# EAGLE design UMC (EAGLE 9.1.3)
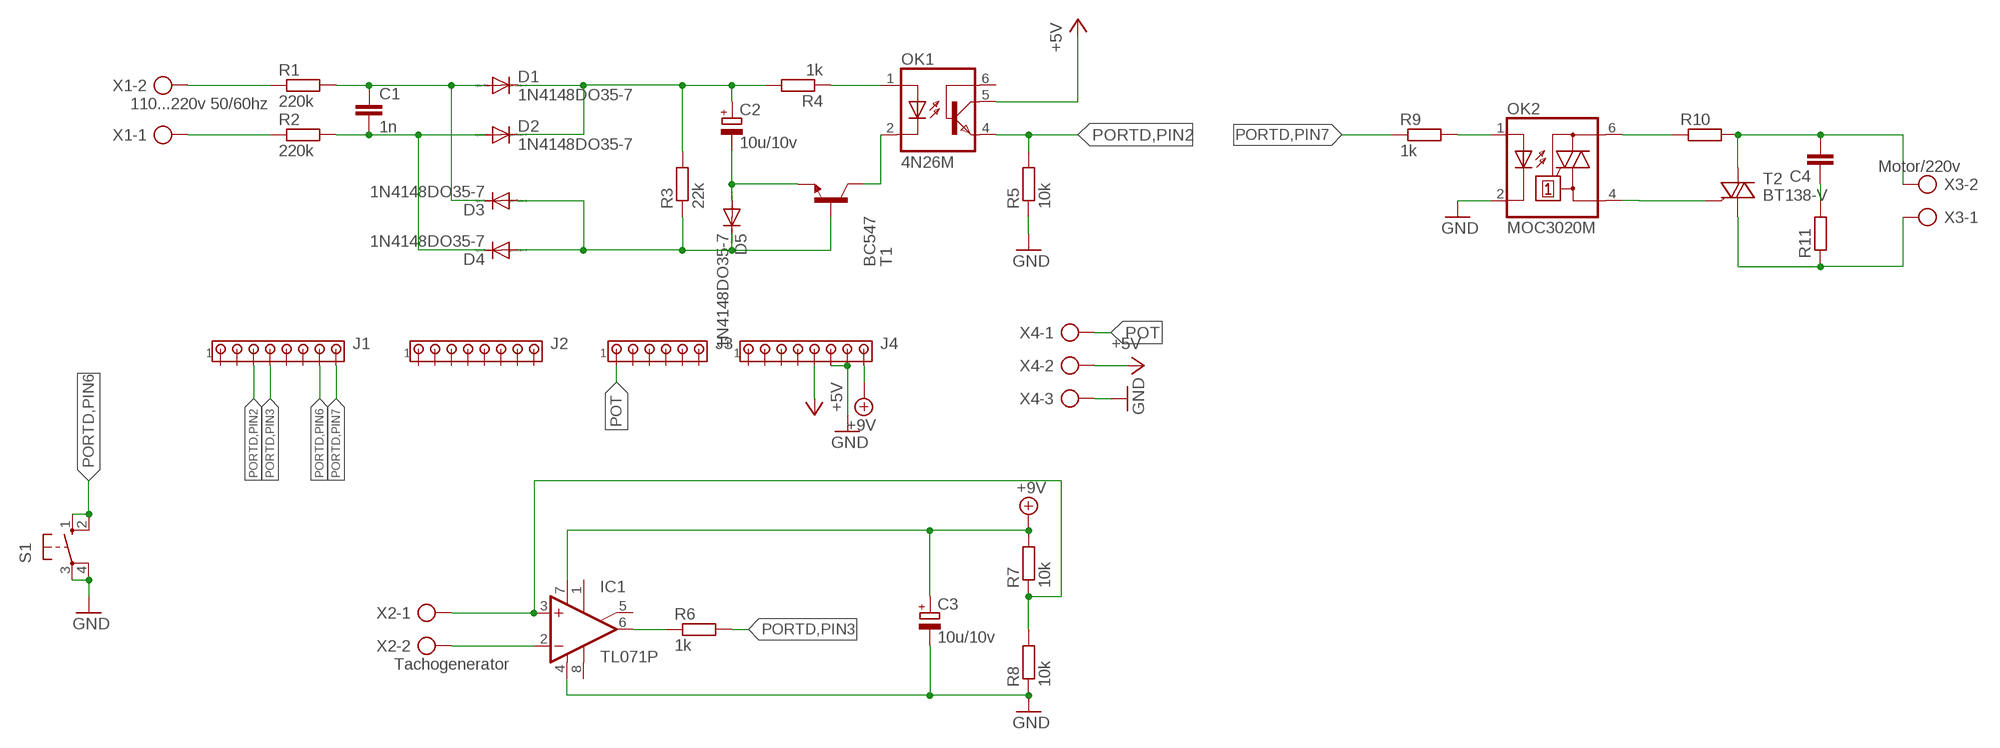
[diagram p0: schematic, sheet 1]

## Parts
C1  1n  C5/2.5  [C5B2.5]
C2  10u/10v  CPOL-EUE2.5-5  [E2,5-5]
C3  10u/10v  CPOL-EUE2.5-5  [E2,5-5]
C4  C15/7  [C15B7]
D1  1N4148DO35-7  [DO35-7]
D2  1N4148DO35-7  [DO35-7]
D3  1N4148DO35-7  [DO35-7]
D4  1N4148DO35-7  [DO35-7]
D5  1N4148DO35-7  [DO35-7]
IC1  TL071P  [DIL08]
J1  MTA08-100  [10X08MTA]
J2  MTA08-100  [10X08MTA]
J3  MTA06-100  [10X06MTA]
J4  MTA08-100  [10X08MTA]
OK1  4N26M  [DIL06]
OK2  MOC3020M  [DIL06]
R1  220k  R-EU_0207/7  [0207/7]
R2  220k  R-EU_0207/7  [0207/7]
R3  22k  R-EU_0207/7  [0207/7]
R4  1k  R-EU_0207/7  [0207/7]
R5  10k  R-EU_0207/7  [0207/7]
R6  1k  R-EU_0207/7  [0207/7]
R7  10k  R-EU_0207/7  [0207/7]
R8  10k  R-EU_0207/7  [0207/7]
R9  1k  R-EU_0207/7  [0207/7]
R10  R-EU_0207/7  [0207/7]
R11  R-EU_0411/12  [0411/12]
S1  10-XX  [B3F-10XX]
T1  BC547  [TO92]
T2  BT138-V  [TO220BV]
X1  110...220v 50/60hz  AK500/2  [AK500/2]
X2  Tachogenerator  AK500/2  [AK500/2]
X3  Motor/220v  AK500/2  [AK500/2]
X4  AK500/3  [AK500/3]

## Nets
+5V: J4.5 OK1.5(COL) X4.2
+9V: C3.+ IC1.7(V+) J4.8 R7.2
GND: C3.- IC1.4(V-) J4.6 J4.7 OK2.2(C) R5.1 R8.1 S1.3(P) S1.4(P1) X4.3
N$1: R1.1 X1.2
N$2: R2.1 X1.1
N$3: C1.1 D1.A D3.C R1.2
N$4: C1.2 D2.A D4.C R2.2
N$5: C2.+ D1.C D2.C R3.2 R4.2
N$6: D3.A D4.A D5.C R3.1 T1.2(B)
N$7: OK1.1(A) R4.1
N$8: OK1.2(C) T1.3(C)
N$9: C2.- D5.A T1.1(E)
N$10: OK2.1(A) R9.2
N$11: IC1.2(-IN) X2.2
N$12: IC1.6(OUT) R6.1
N$13: OK2.6(A2) R10.1
N$14: IC1.3(+IN) R7.1 R8.2 X2.1
N$15: C4.2 R10.2 T2.T2(A2) X3.2
N$16: C4.1 R11.2
N$17: OK2.4(A1) T2.G
N$18: R11.1 T2.T1(A1) X3.1
PORTD,PIN2: J1.3 OK1.4(EMI) R5.2
PORTD,PIN3: J1.4 R6.2
PORTD,PIN6: J1.7 S1.1(S) S1.2(S1)
PORTD,PIN7: J1.8 R9.1
POT: J3.1 X4.1
Unconnected: IC1.1(ON1) IC1.5(ON2) IC1.8(OPT) J1.1 J1.2 J1.5 J1.6 J2.1 J2.2 J2.3 J2.4 J2.5 J2.6 J2.7 J2.8 J3.2 J3.3 J3.4 J3.5 J3.6 J4.1 J4.2 J4.3 J4.4 OK1.6(BAS)

## Library data of the parts
C1 C4 = capacitor-wima:C: CAPACITOR naming: grid - package width
C2 C3 = resistor:CPOL-EU: POLARIZED CAPACITOR, European symbol
D1-D5 = diode:1N4148: DIODE high speed (Philips)
IC1 = linear:TL071: OP AMP
J1 J2 J4 = con-amp:MTA08-100: AMP connector
J3 = con-amp:MTA06-100: AMP connector Connection corrected 2014-09-19
OK1 = optocoupler:4N*?M: General Purpose 6-Pin Phototransistor Optocouplers Source: http://www.fairchildsemi.com/ds/4N/4N35-M.pdf; MPN: 4N26-M; OC_FARNELL: 1021350; OC_NEWARK: 98K9089
OK2 = optocoupler:MOC30*M: RANDOM-PHASE OPTOISOLATORS TRIAC DRIVER OUTPUT Source: http://www.fairchildsemi.com MOC3020-M.pdf; MF: FAIRCHILD SEMICONDUCTOR; MPN: MOC3020-M; OC_FARNELL: 1505425; OC_NEWARK: 72K8895
R1-R9 = resistor:R-EU_: RESISTOR, European symbol
R10 R11 = rcl:R-EU_: RESISTOR, European symbol; SPICEPREFIX: R
S1 = switch-omron:10-XX: OMRON SWITCH; MPN: B3F-1000; OC_FARNELL: 176432; OC_NEWARK: 36M3542
T1 = transistor:BC547: NPN TRANSISTOR
T2 = triac:BT138: TRIAC Source: http://www.semiconductors.philips.com BT138_SERIES_2.pdf
X1-X3 = con-ptr500:AK500/2: CONNECTOR; OC_FARNELL: unknown; OC_NEWARK: unknown
X4 = con-ptr500:AK500/3: CONNECTOR; OC_FARNELL: unknown; OC_NEWARK: unknown

## Board
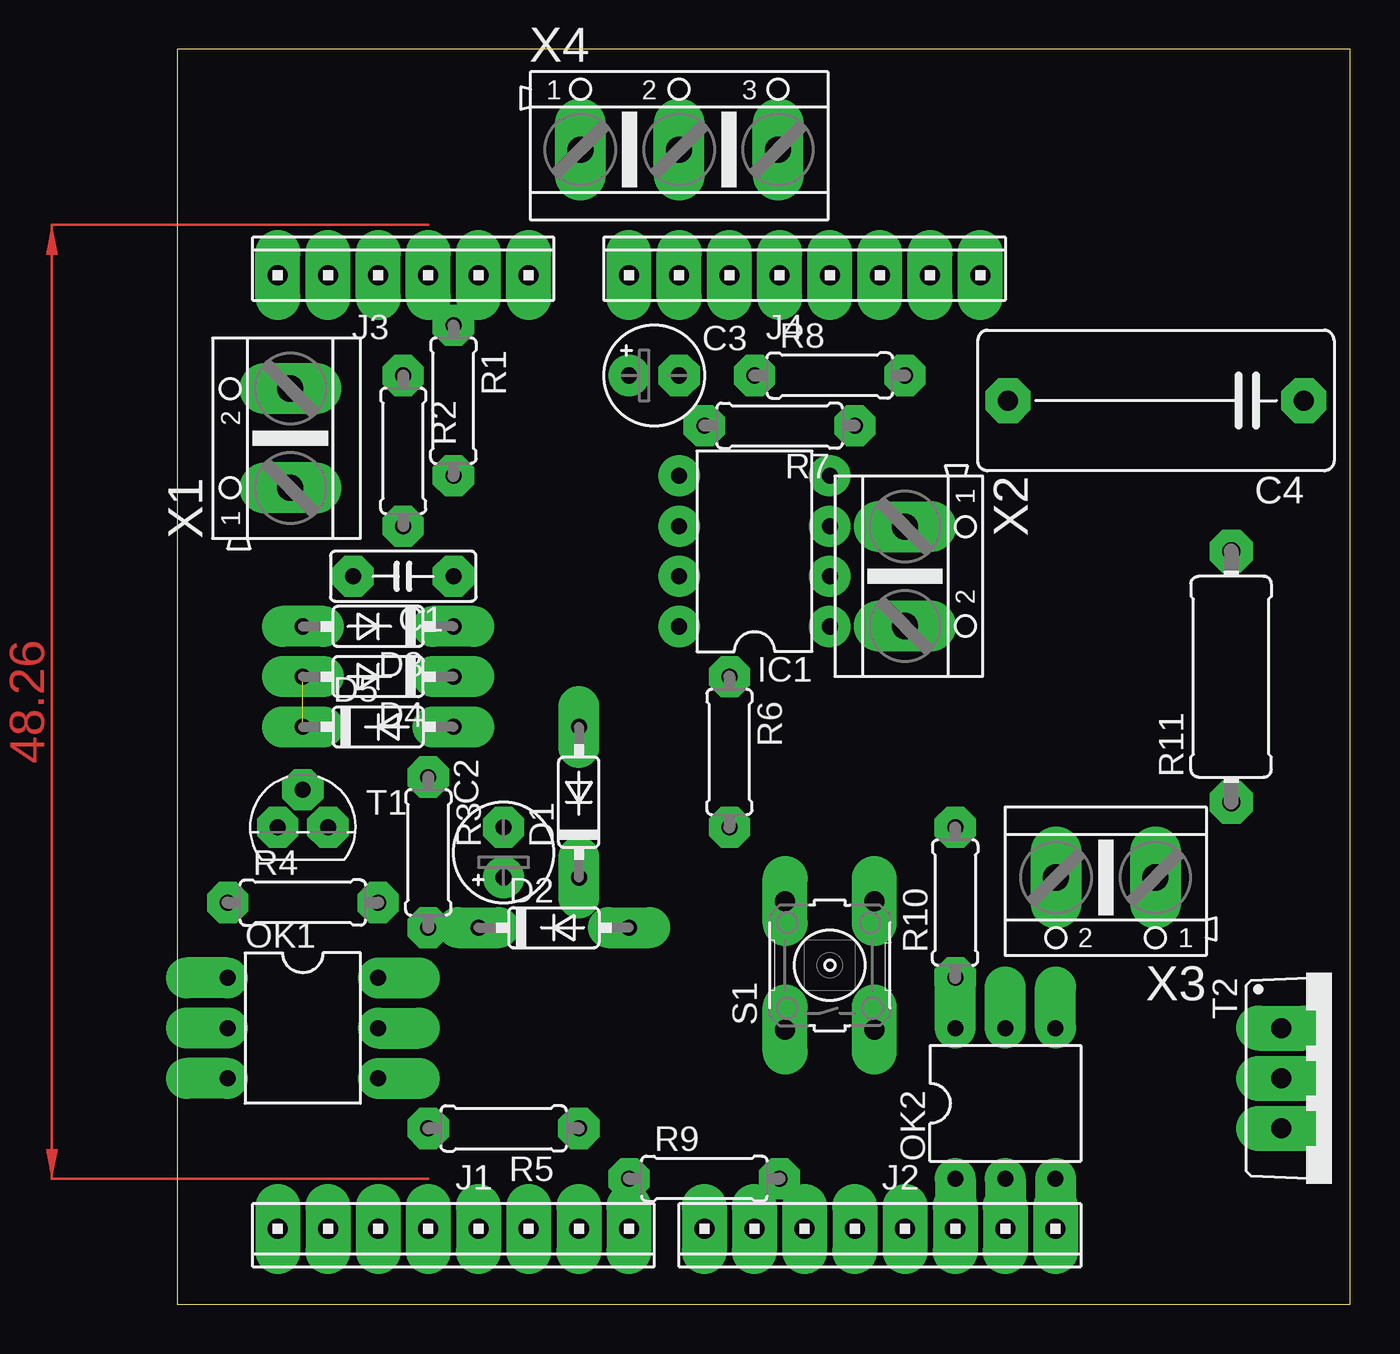
[diagram p1: board, top side]
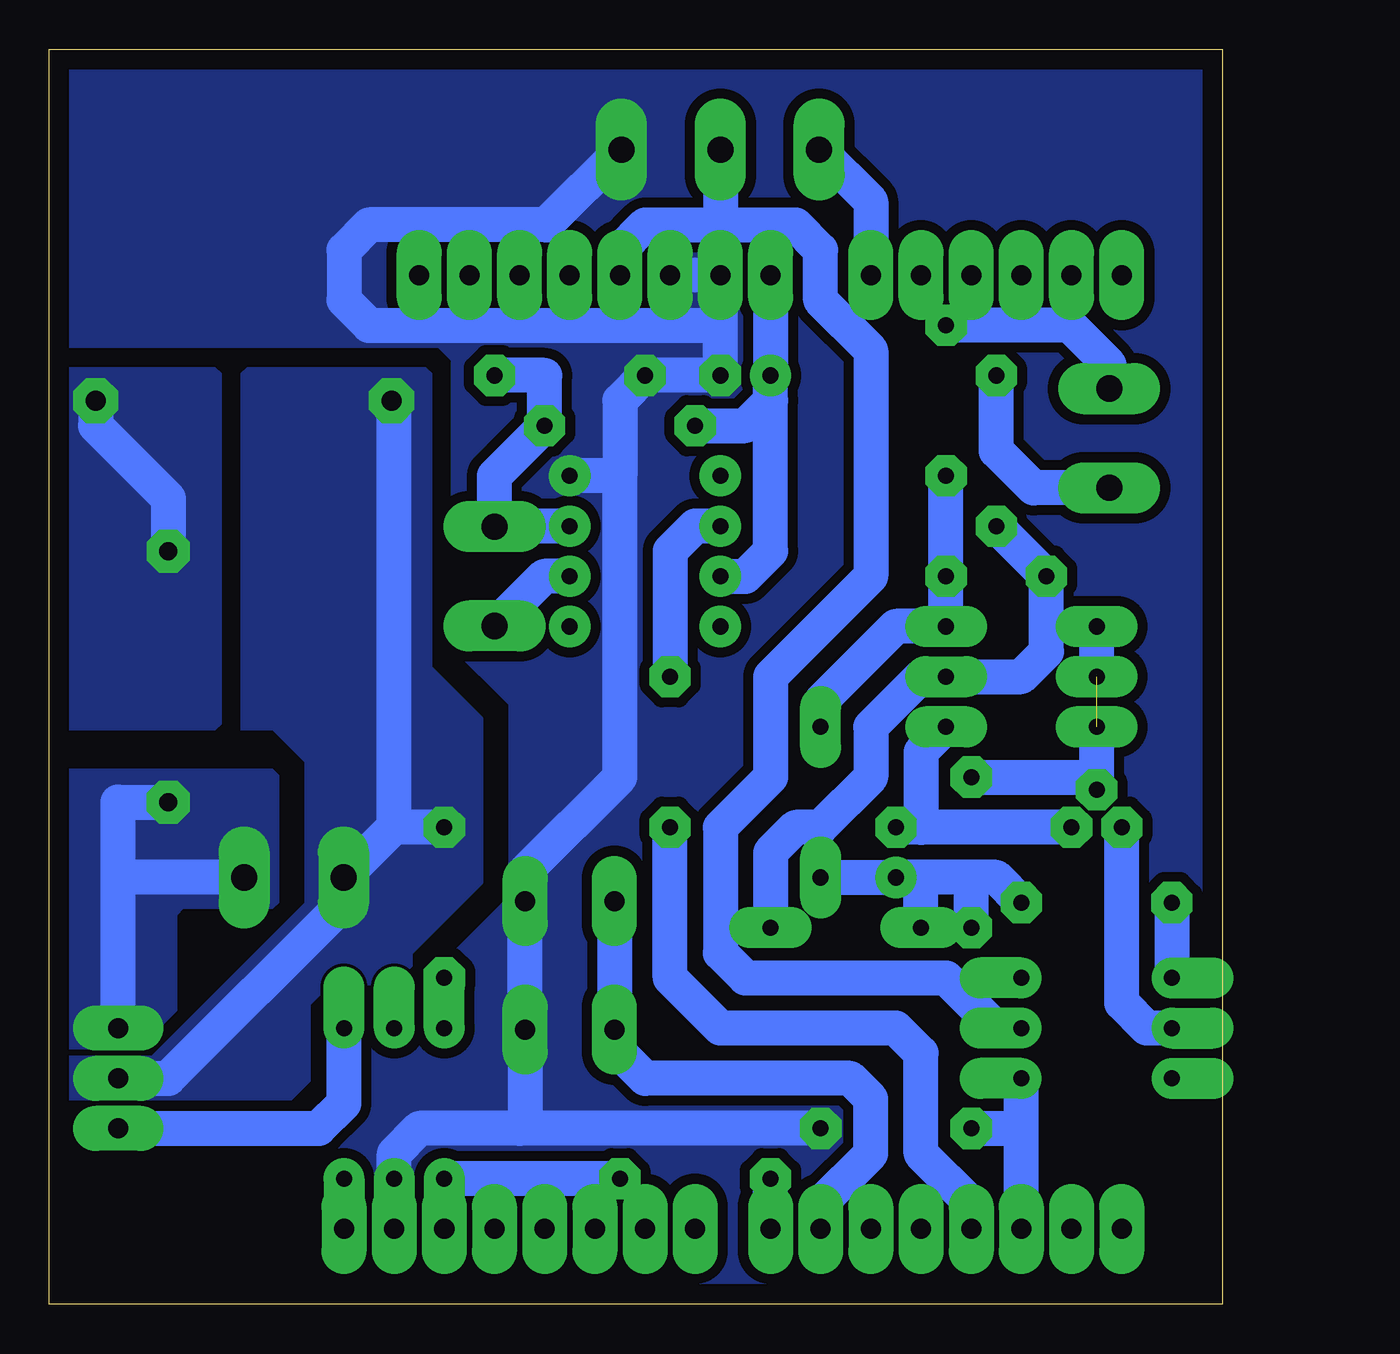
[diagram p2: board, bottom side, seen from below]

Size 59.36 x 63.49 mm. Coordinates in mm from the lower left corner, seen from the top.
Outline: 0,0 59.36,0 59.36,63.49 0,63.49 0,0
Copper layers (1*16): Top 0.035mm / dielectric 1.5mm / Bottom 0.035mm
Design rules "default *": minimum track width 6mil, minimum drill 0.35mm, track to track 6mil, track to pad 6mil, pad to pad 6mil, via to via 6mil, smd to smd 6mil, copper to edge 40mil, drill to drill 6mil, minimum pad ring 25mil, minimum via ring 8mil, stop-mask expansion 4mil, vias tented up to drill 0mil, thermal gap 10mil

### Footprints (pad centres in the part's own frame; a part is rotated, then mirrored left to right if it is on the bottom)
C5B2.5 = drill 0.813 pad 1.6 octagon: 1 -2.54,0; 2 2.54,0
E2,5-5 = drill 0.813 pad 1.6: + -1.27,0 | drill 0.813 pad 1.6 octagon: - 1.27,0
C15B7 = drill 1.016 pad 2.159 octagon: 1 -7.493,0; 2 7.493,0
DO35-7 = drill 0.813 long: A 3.81,0; C -3.81,0
DIL08 = drill 0.813 pad 1.27: 1 -3.81,-3.81; 2 -1.27,-3.81; 3 1.27,-3.81; 4 3.81,-3.81; 5 3.81,3.81; 6 1.27,3.81; 7 -1.27,3.81; 8 -3.81,3.81
10X08MTA = drill 1.016 long: 1 8.89,0; 2 6.35,0; 3 3.81,0; 4 1.27,0; 5 -1.27,0; 6 -3.81,0; 7 -6.35,0; 8 -8.89,0
10X06MTA = drill 1.016 long: 1 6.35,0; 2 3.81,0; 3 1.27,0; 4 -1.27,0; 5 -3.81,0; 6 -6.35,0
DIL06 = drill 0.813 offset: 1 -2.54,-3.81; 2 0,-3.81; 3 2.54,-3.81; 4 2.54,3.81; 5 0,3.81; 6 -2.54,3.81
0207/7 = drill 0.813 octagon: 1 -3.81,0; 2 3.81,0
0411/12 = drill 0.914 octagon: 1 -6.35,0; 2 6.35,0
B3F-10XX = drill 1.016 long: 1 -3.251,2.261; 2 3.251,2.261; 3 -3.251,-2.261; 4 3.251,-2.261
TO92 = drill 0.813 octagon: 1 1.27,0; 2 0,1.905; 3 -1.27,0
TO220BV = drill 1.016 long: G 2.54,-2.54; T1 -2.54,-2.54; T2 0,-2.54
AK500/2 = drill 1.321 long: 1 -2.515,0; 2 2.515,0
AK500/3 = drill 1.321 long: 1 -5.004,0; 2 0,0; 3 5.004,0

### Placement (x,y rotation side)
C1  11.43,36.83 180 top
C2  16.51,22.86 90 top
C3  24.13,46.99 0 top
C4  49.53,45.72 180 top
D1  20.32,25.4 90 top
D2  19.05,19.05 0 top
D3  10.16,34.29 180 top
D4  10.16,31.75 180 top
D5  10.16,29.21 0 top
IC1  29.21,38.1 90 top
J1  13.97,3.81 180 top
J2  35.56,3.81 180 top
J3  11.43,52.07 0 top
J4  31.75,52.07 0 top
OK1  6.35,13.97 270 top
OK2  41.91,10.16 0 top
R1  13.97,45.72 270 top
R2  11.43,43.18 270 top
R3  12.7,22.86 270 top
R4  6.35,20.32 0 top
R5  16.51,8.89 180 top
R6  27.94,27.94 270 top
R7  30.48,44.45 180 top
R8  33.02,46.99 0 top
R9  26.67,6.35 0 top
R10  39.37,20.32 90 top
R11  53.34,31.75 90 top
S1  33.02,17.14 90 top
T1  6.35,24.13 0 top
T2  58.42,11.43 270 top
X1  5.71,43.81 90 top
X2  36.83,36.83 270 top
X3  46.99,21.59 180 top
X4  25.4,58.42 0 top

### Tracks (layer width: path | path; a pad name or v marks a point on that pad's centre or on a via)
+5V
  Bottom 1.778: 30.4,52.15 J4.5 30.48,53.34 29.21,54.61 25.4,54.61 | 25.4,54.61 21.59,54.61 20.32,53.34 20.32,50.8 17.78,48.26 17.78,36.83 22.86,31.75 22.86,26.67 25.4,24.13 25.4,17.78 24.13,16.51 13.97,16.51 11.43,13.97 OK1.5 | X4.2 25.4,54.61
+9V
  Bottom 1.778: J4.8 C3.+ 22.86,45.72 | R7.2 24.13,44.45 22.86,45.72 | IC1.7 24.13,36.83 22.86,38.1 22.86,45.72
GND
  Bottom 1.778: J4.6 J4.7 25.4,49.53 | 25.4,49.53 C3.- R8.1 30.48,45.72 30.48,41.91 | 30.48,41.91 IC1.4 | R5.1 35.56,8.89 | 35.56,8.89 40.64,8.89 41.91,7.62 OK2.2 | 30.48,41.91 30.48,26.67 35.28,21.87 S1.4 S1.3 35.28,9.17 35.56,8.89 | X4.3 34.21,54.61 43.18,54.61 44.45,53.34 44.45,50.8 43.18,49.53 25.4,49.53
  pour Bottom (isolate 0.508, no thermals): 0.32,63.23 59.03,63.23 59.35,62.9 59.35,62.9 59.35,49.35 58.39,48.39 39.68,48.39 39.03,47.74 39.03,33.23 36.13,30.32 36.13,20.65 41.61,15.16 44.84,15.16 45.48,14.52 45.48,14.52 45.48,10.65 46.13,10 59.03,10 59.35,9.68 59.35,9.68 59.35,0.32 59.03,0 0.32,0 0,0.32 0,62.9
N$1
  Bottom 1.778: X1.2 5.71,47.53 7.71,49.53 R1.1
N$2
  Bottom 1.778: X1.1 9.55,41.3 11.43,43.18 R2.1
N$3
  Bottom 1.778: R1.2 C1.1 D3.C 16.51,34.29 20.32,30.48 D1.A
N$4
  Bottom 1.778: D2.A 22.86,22.86 21.59,24.13 20.32,24.13 17.78,26.67 17.78,29.21 15.24,31.75 D4.C 10.16,31.75 8.89,33.02 C1.2 R2.2
N$5
  Bottom 1.778: R4.2 11.43,21.59 12.7,21.59 | 12.7,21.59 15.24,21.59 | 15.24,21.59 C2.+ D1.C | R3.2 12.7,21.59 | D2.C 15.24,21.59
N$6  (1 unrouted)
  Bottom 1.778: T1.2 6.35,26.67 | 6.35,26.67 D5.C | D4.A D3.A | R3.1 6.35,26.67
N$7
  Bottom 1.778: R4.1 OK1.1
N$8
  Bottom 1.778: OK1.2 3.81,13.97 5.08,15.24 T1.3
N$9
  Bottom 1.778: T1.1 15.24,24.13 | 15.24,24.13 C2.- | D5.A 15.24,27.94 15.24,24.13
N$10
  Bottom 1.778: R9.2 OK2.1
N$11
  Bottom 1.778: X2.2 34.31,36.83 IC1.2
N$12
  Bottom 1.778: IC1.6 26.67,39.37 27.94,38.1 R6.1
N$13
  Bottom 1.778: OK2.6 R10.1
N$14
  Bottom 1.778: R8.2 34.29,46.99 R7.1 36.83,41.91 X2.1 36.8,39.37 IC1.3
N$15
  Bottom 1.778: C4.2 41.94,45.62 41.94,24.13 | R10.2 41.94,24.13 | 41.94,24.13 X3.2 44.48,20.3 53.34,11.43 T2.T2
  pour Bottom (no thermals): 56.13,12.58 59.03,12.58 59.35,12.26 59.35,10.65 59.35,10.65 59.03,10.32 47.1,10.32 46.13,11.29 46.13,15.16 45.16,16.13 41.94,16.13 40.97,17.1 40.97,17.74 37.42,21.29 37.42,23.23 37.42,29.68 37.42,29.68 37.74,30 40,32.26 40,32.58 40,47.1 40.32,47.42 40.32,47.42 49.35,47.42 49.68,47.1 49.68,29.03 48.06,29.03 46.77,27.74 46.45,27.42 46.45,20.32 54.19,12.58
N$16
  Bottom 1.778: 57.15,45.59 C4.1 57.02,44.45 53.34,40.77 R11.2
  pour Bottom (no thermals): 59.35,29.03 50.97,29.03 50.65,29.35 50.65,47.1 50.97,47.42 59.03,47.42 59.35,47.1
N$17
  Bottom 1.778: T2.G 45.72,8.89 44.45,10.16 OK2.4
N$18
  Bottom 1.778: R11.1 53.31,25.38 | 53.31,25.4 R11.1 | T2.T1 55.88,21.59 | 55.88,21.59 55.88,25.4 R11.1 | X3.1 55.88,21.59
  pour Bottom (no thermals): 56.13,12.9 59.03,12.9 59.35,13.23 59.35,13.23 59.35,26.77 59.03,27.1 48.06,27.1 47.74,26.77 47.74,20.32 48.06,20 52.58,20 52.9,19.68 52.9,14.84 54.84,12.9 55.16,12.9 55.48,12.9 55.81,12.9
PORTD,PIN2
  Bottom 1.778: 10.16,8.89 10.16,10.16 OK1.4 | R5.2 10.16,8.89 | J1.3 10.16,8.89
PORTD,PIN3
  Bottom 1.778: J1.4 12.7,5.08 15.24,7.62 15.24,12.7 16.51,13.97 25.4,13.97 27.94,16.51 R6.2
PORTD,PIN6
  Bottom 1.778: J1.7 20.32,5.08 17.78,7.62 17.78,10.39 18.82,11.43 29.21,11.43 30.76,12.98 S1.1 S1.2
PORTD,PIN7
  Bottom 1.778: J1.8 R9.1
POT
  Bottom 1.778: X4.1 17.78,55.8 J3.1
(copper drawn outside any net)
  shapes: Top area x1